# Altium schematic sheet BRELOK_DWS.SchDoc
size A4
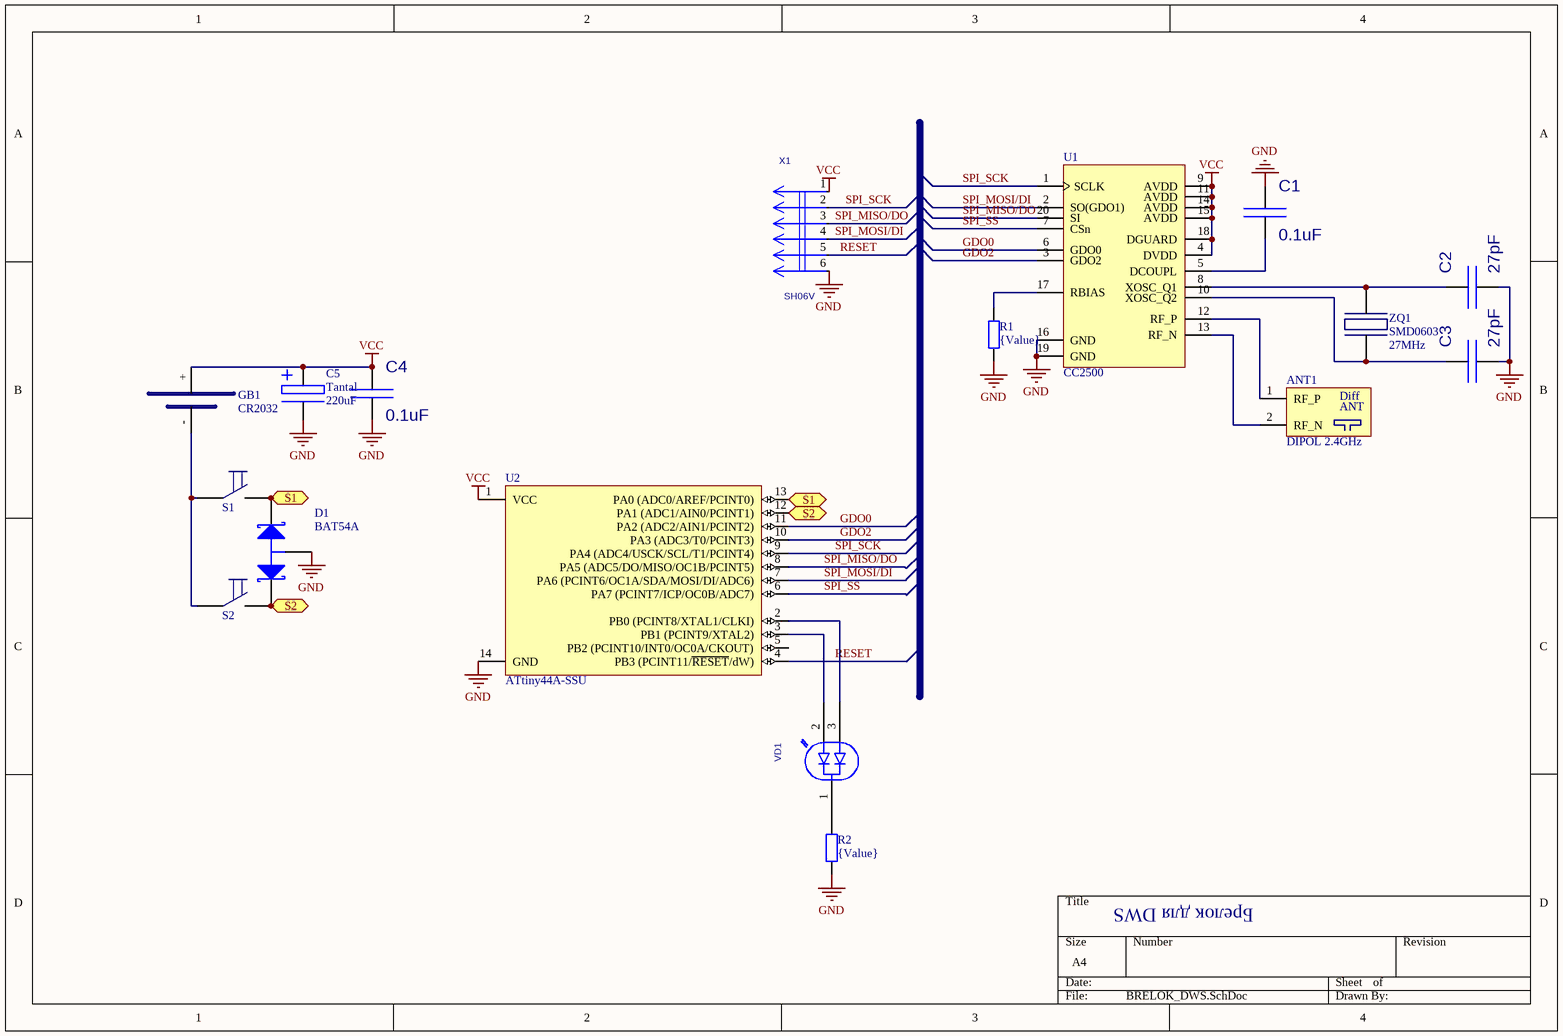
[diagram p0: BRELOK_DWS.SchDoc]

## Parts
ANT1  DIPOL 2.4GHz  [ANT_Dipol_2.4GHz]
C1  value 0.1uF  [C0805]  (hidden comment: KONDENS_SMD)
C2  value 27pF  [C0805]  (hidden comment: KONDENS_SMD)
C3  value 27pF  [C0805]  (hidden comment: KONDENS_SMD)
C4  value 0.1uF  [C0805]  (hidden comment: KONDENS_SMD)
C5  Tantal  value 220uF  [SMD_D]
D1  BAT54A  [SOT23_N]
GB1  CR2032  [BAT_Holder_CR2032]
R1  value {Value}  [C0805]  (hidden comment: RES)
R2  value {Value}  [C0805]  (hidden comment: RES)
S1  KAN0642-0501B  [KAN0642-0501B]  (value not drawn)
S2  KAN0642-0501B  [KAN0642-0501B]  (value not drawn)
U1  CC2500  [VQFN20]
U2  ATtiny44A-SSU  [14S1_N]
VD1  LIGHTDIODE2  [LIGHTDIODE2]  (value not drawn)
X1  SH06V  [SH06V]
ZQ1  SMD0603  value 27MHz  [Quartz_SMD0603]

## Ports
S1, S2

## Nets
GND: C1.1(A) C2.2(B) C3.2(B) C4.2(B) C5.2(MINUS) D1.3(A) R1.1 R2.1 U1.16(GND) U1.19(GND) U2.14(GND) X1.6
VCC: C4.1(A) C5.1(PLUS) GB1.+ U1.4(DVDD) U1.9(AVDD) U1.11(AVDD) U1.14(AVDD) U1.15(AVDD) U1.18(DGUARD) U2.1(VCC) X1.1
GDO0: U1.6(GDO0) U2.11(PA2_(ADC2/AIN1/PCINT2))
GDO2: U1.3(GDO2) U2.10(PA3_(ADC3/T0/PCINT3))
RESET: U2.4(PB3_(PCINT11/~{RESET}/dW)) X1.5
S1: D1.1(K1) S1.2 U2.13(PA0_(ADC0/AREF/PCINT0)) ; port S1
S2: D1.2(K2) S2.2 U2.12(PA1_(ADC1/AIN0/PCINT1)) ; port S2
SPI_MISO/DO: U1.20(SI) U2.8(PA5_(ADC5/DO/MISO/OC1B/PCINT5)) X1.3
SPI_MOSI/DI: U1.2(SO(GDO1)) U2.7(PA6_(PCINT6/OC1A/SDA/MOSI/DI/ADC6)) X1.4
SPI_SCK: U1.1(SCLK) U2.9(PA4_(ADC4/USCK/SCL/T1/PCINT4)) X1.2
SPI_SS: U1.7(CSn) U2.6(PA7_(PCINT7/ICP/OC0B/ADC7))
NetANT1_1: ANT1.1(RF_P) U1.12(RF_P)
NetANT1_2: ANT1.2(RF_N) U1.13(RF_N)
NetC1_2: C1.2(B) U1.5(DCOUPL)
NetC2_1: C2.1(A) U1.8(XOSC_Q1) ZQ1.3
NetC3_1: C3.1(A) U1.10(XOSC_Q2) ZQ1.1
NetGB1_-: GB1.- S1.1 S2.1
NetR1_2: R1.2 U1.17(RBIAS)
NetR2_2: R2.2 VD1.1
NetU2_2: U2.2(PB0_(PCINT8/XTAL1/CLKI)) VD1.3
NetU2_3: U2.3(PB1_(PCINT9/XTAL2)) VD1.2

Not connected (* = marked no-connect by the designer): U2 5(PB2_(PCINT10/INT0/OC0A/CKOUT)); X1 7(GND) 8(GND)

## Notes on the sheet
- Брелок для DWS
- (in symbol ANT_dipol_2.4GHz) Diff; ANT

## Library data of the parts
ANT1 = ANT_dipol_2.4GHz
C5 = Capasitor_POL_Tantal: SMD_D
D1 = BAT54A: Schottky Barrier Double Diode; Published: 17-Sep-2003; LatestRevisionDate: 12-Dec-2006; LatestRevisionNote: IPC-7351 Footprint Added.; DatasheetVersion: 4-Mar-2002; PackageVersion: May-1999; PackageReference: SOT23; Publisher: Altium Limited; PackageDescription: 3-Pin SOT-23 Package 0.95 mm Pitch, 2.3 mm Lead Span; ComponentLink1Description: Manufacturer Link; ComponentLink1URL: http://www.semiconductors.philips.com/; ComponentLink2Description: Datasheet; ComponentLink2URL: http://www.semiconductors.philips.com/acrobat/datasheets/BAT54_SERIES_4.pdf
GB1 = BAT_Holder_CR2032: BTH-W39-20
R1 R2 = RES: Resistor
U2 = ATtiny44A-SSU: 8-bit AVR Microcontroller, 1.8-5.5V, 4KB Flash, 256 Bytes EEPROM, 256 Bytes SRAM, 14-pin SOIC, Industrial Grade (-40°C to 85°C), Pb-Free; Published: 1-Apr-2010; DatasheetVersion: revA, Dec-2008; PackageVersion: revA, Feb-2002; PackageReference: 14S1; Publisher: Altium Limited; PackageDescription: 14-Lead, 0.150” Wide Body, Plastic Gull Wing Small Outline Package (SOIC); Supplier 1: Digi-Key; Supplier Part Number 1: ATTINY44A-SSU-ND; Supplier 2: Farnell; Supplier Part Number 2: 1699397; Supplier 3: Mouser; Supplier Part Number 3: 556-ATTINY44A-SSU; Code_JEDEC: MS-012-AB; Code_IPC: SOIC127P600-14; ComponentLink1Description: Manufacturer Link; ComponentLink1URL: http://www.atmel.com/products/avr/default.asp?; ComponentLink2Description: ATtiny24A/44A Datasheet; ComponentLink2URL: http://www.atmel.com/dyn/resources/prod_documents/doc8183.pdf; ComponentLink3Description: ATtiny24A/44A Summary; ComponentLink3URL: http://www.atmel.com/dyn/resources/prod_documents/8183S.pdf; ComponentLink4Description: Atmel.com Home; ComponentLink4URL: http://www.atmel.com
ZQ1 = Quartz_SMD0603
VD1 = LIGHTDIODE2: Value: *
X1 = SH06V: Value: *